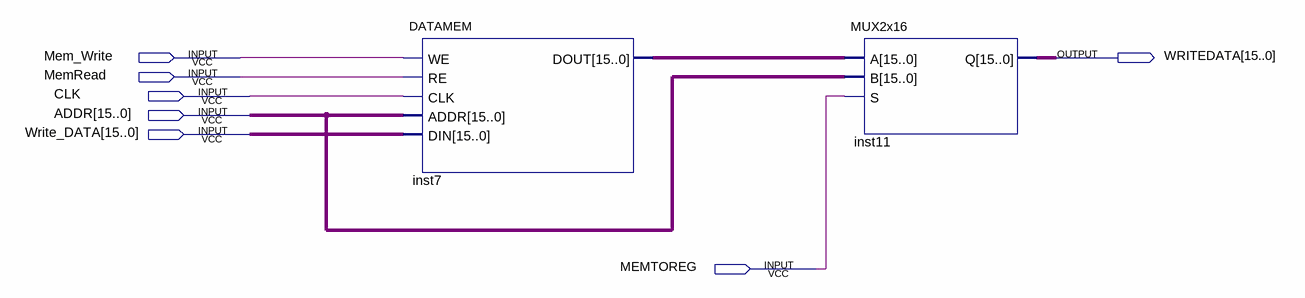
[diagram p0: schematic sheet]
// Quartus schematic datamem.bdf as structural Verilog: 2 symbols, 7 pins
module datamem (
  input  Mem_Write,
  input  MemRead,
  input  CLK,
  input  [15:0] ADDR,
  input  [15:0] Write_DATA,
  input  MEMTOREG,
  output [15:0] WRITEDATA
);

  wire [15:0] inst7_dout;

  DATAMEM inst7 (.WE(Mem_Write), .RE(MemRead), .CLK(CLK), .ADDR(ADDR), .DIN(Write_DATA), .DOUT(inst7_dout));
  MUX2x16 inst11 (.A(inst7_dout), .B(ADDR), .S(MEMTOREG), .Q(WRITEDATA));
endmodule
